# Altium project Air_Unit_240316.PrjPcb
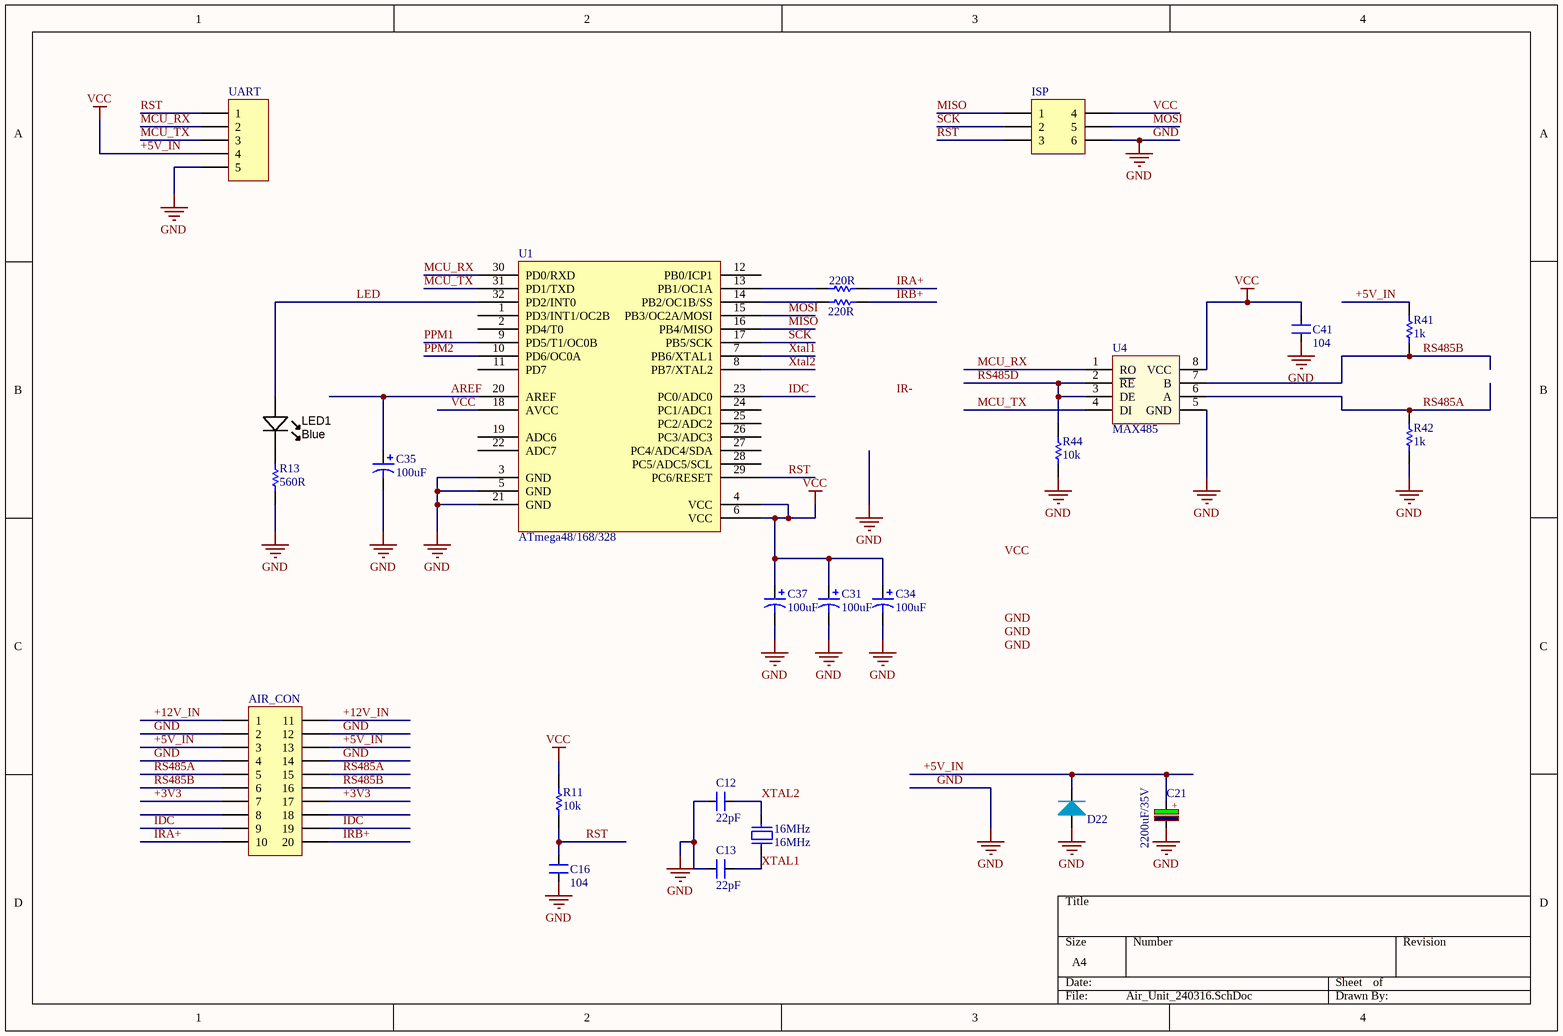
[diagram p0: Air_Unit_240316.SchDoc]
1 sheet, 24 parts. Net scope: global (net labels, ports and power ports of the same name join across sheets).
Board file: Air_Unit_240316.PcbDoc

## Sheet Air_Unit_240316.SchDoc
size A4

### Parts
16MHz  16MHz  [XT2]
AIR_CON  Header 10X2A  [OMC10]  (value not drawn)
C12  value 22pF  [CAPC1608N]  (hidden comment: CAP NP)
C13  value 22pF  [CAPC1608N]  (hidden comment: CAP NP)
C16  value 104  [CAPC1608N]  (hidden comment: CAP NP)
C21  2200uF/35V  [CAP_ELEC_SIZE_G]
C31  value 100uF  [CAPC2012N_F]  (hidden comment: Cap)
C34  value 100uF  [CAPC2012N_F]  (hidden comment: Cap)
C35  value 100uF  [CAPC2012N_F]  (hidden comment: Cap)
C37  value 100uF  [CAPC2012N_F]  (hidden comment: Cap)
C41  value 104  [CAPC2012N_F]  (hidden comment: 100nF/104)
D22  Diode  [DO-214AC]  (value not drawn)
ISP  Header 3X2A  [HDR2X3_CEN]  (value not drawn)
LED1  Blue  [LED-0805-K]
R11  value 10k  [RESC1608N_ZERO]  (hidden comment: Res)
R12  value 220R  [RESC2012N_F]  (hidden comment: Res)
R13  value 560R  [RESC2012N_F]  (hidden comment: Res)
R14  value 220R  [RESC2012N_F]  (hidden comment: Res)
R41  1k  [RESC1608N_ZERO]
R42  1k  [RESC1608N_ZERO]
R44  value 10k  [RESC1608N_ZERO]  (hidden comment: 330R)
U1  ATmega48/168/328  [32PIN]
U4  MAX485  [SO-8]
UART  Header 5  [HDR1X5]  (value not drawn)

### Nets
+5V_IN: AIR_CON.3 AIR_CON.13 C21.1 C31.1 C34.1 C37.1 C41.2 D22.2(K) ISP.4 R11.2 R41.2 U1.4(VCC) U1.6(VCC) U1.18(AVCC) U4.8(VCC) UART.4  [also labelled VCC]
GND: AIR_CON.2 AIR_CON.4 AIR_CON.12 AIR_CON.14 C12.2 C13.2 C16.1 C21.2 C31.2 C34.2 C35.2 C37.2 C41.1 D22.1(A) ISP.6 R13.1 R42.1 R44.1 U1.3(GND) U1.5(GND) U1.21(GND) U4.5(GND) UART.5
+3V3: AIR_CON.7 AIR_CON.17
+12V_IN: AIR_CON.1 AIR_CON.11
AREF: C35.1 U1.20(AREF)
IDC: AIR_CON.9 AIR_CON.19 U1.23(PC0/ADC0)
IRA+: AIR_CON.10 R12.1
IRB+: AIR_CON.20 R14.1
LED: LED1.A U1.32(PD2/INT0)
MCU_RX: U1.30(PD0/RXD) U4.1(RO) UART.2
MCU_TX: U1.31(PD1/TXD) U4.4(DI) UART.3
MISO: ISP.1 U1.16(PB4/MISO)
MOSI: ISP.5 U1.15(PB3/OC2A/MOSI)
PPM1: U1.9(PD5/T1/OC0B)
PPM2: U1.10(PD6/OC0A)
RS485A: AIR_CON.5 AIR_CON.15 R42.2 U4.6(A)
RS485B: AIR_CON.6 AIR_CON.16 R41.1 U4.7(B)
RS485D: R44.2 U4.2(~{RE}) U4.3(DE)
RST: C16.2 ISP.3 R11.1 U1.29(PC6/RESET) UART.1
SCK: ISP.2 U1.17(PB5/SCK)
Xtal1: 16MHz.1 C13.1 U1.7(PB6/XTAL1)
Xtal2: 16MHz.2 C12.1 U1.8(PB7/XTAL2)
NetLED1_K: LED1.K R13.2
NetR12_2: R12.2 U1.13(PB1/OC1A)
NetR14_2: R14.2 U1.14(PB2/OC1B/SS)

Not connected (* = marked no-connect by the designer): AIR_CON 8 18; U1 1(PD3/INT1/OC2B) 2(PD4/T0) 11(PD7) 12(PB0/ICP1) 19(ADC6) 22(ADC7) 24(PC1/ADC1) 25(PC2/ADC2) 26(PC3/ADC3) 27(PC4/ADC4/SDA) 28(PC5/ADC5/SCL)

### Notes on the sheet
- Labels drawn without touching a wire or pin: GND, IR-, VCC
- (in symbol CP4) +

### Library data of the parts
16MHz = Crystal
AIR_CON = Header 10X2A: Header, 10-Pin, Dual row; LatestRevisionDate: 17-Jul-2002; LatestRevisionNote: Re-released for DXP Platform.; Publisher: Altium Limited
C21 = CP4: Cap 1000uF/16V - 220uF/50V; Description 5: 4,7uF>10uF/250V_3,3uF>10uF/400V - 2,2uF>4,7uF/450V; Description 1: 2200uF-3300uF/6,3V - 1000uF-2200uF/10V; Description 2: 1000uF/16V - 470uF => 1000uF/25V - 100uF/100V; Description 3: 330uF>470uF/35V_220uF>470uF/50V_10uF>22uF/250V; Description 4: 220uF => 330uF/63V - 10uF =>33uF/160 - 200V; Value: 1000uF/16V
C41 = CAP NP
D22 = Diode: pin to pad: 1>A 2>K
ISP = Header 3X2A: Header, 3-Pin, Dual row; LatestRevisionDate: 17-Jul-2002; LatestRevisionNote: Re-released for DXP Platform.; Publisher: Altium Limited
LED1 = LED_SMD_Blue_0805_100mcd: LED 0805 SMD Blue 100mcd 470nm; Manufacturer 1: Ligitek; Manufacturer Part Number 1: LG-170DBKZ-CT; Material: InGaN/GaN; Ratings: 100 mcd; 470 nm; Package / Case: 0805; Value: Blue; Color: Blue
R41 R42 R44 = Res: Tro dan
  R41 R42: Value: 1k
U4 = MAX485: RS232 - RS485 (Same sn75176)
UART = Header 5: Header, 5-Pin; LatestRevisionDate: 17-Jul-2002; LatestRevisionNote: Re-released for DXP Platform.; Publisher: Altium Limited